# EAGLE schematic lab (EAGLE 7.6.0)
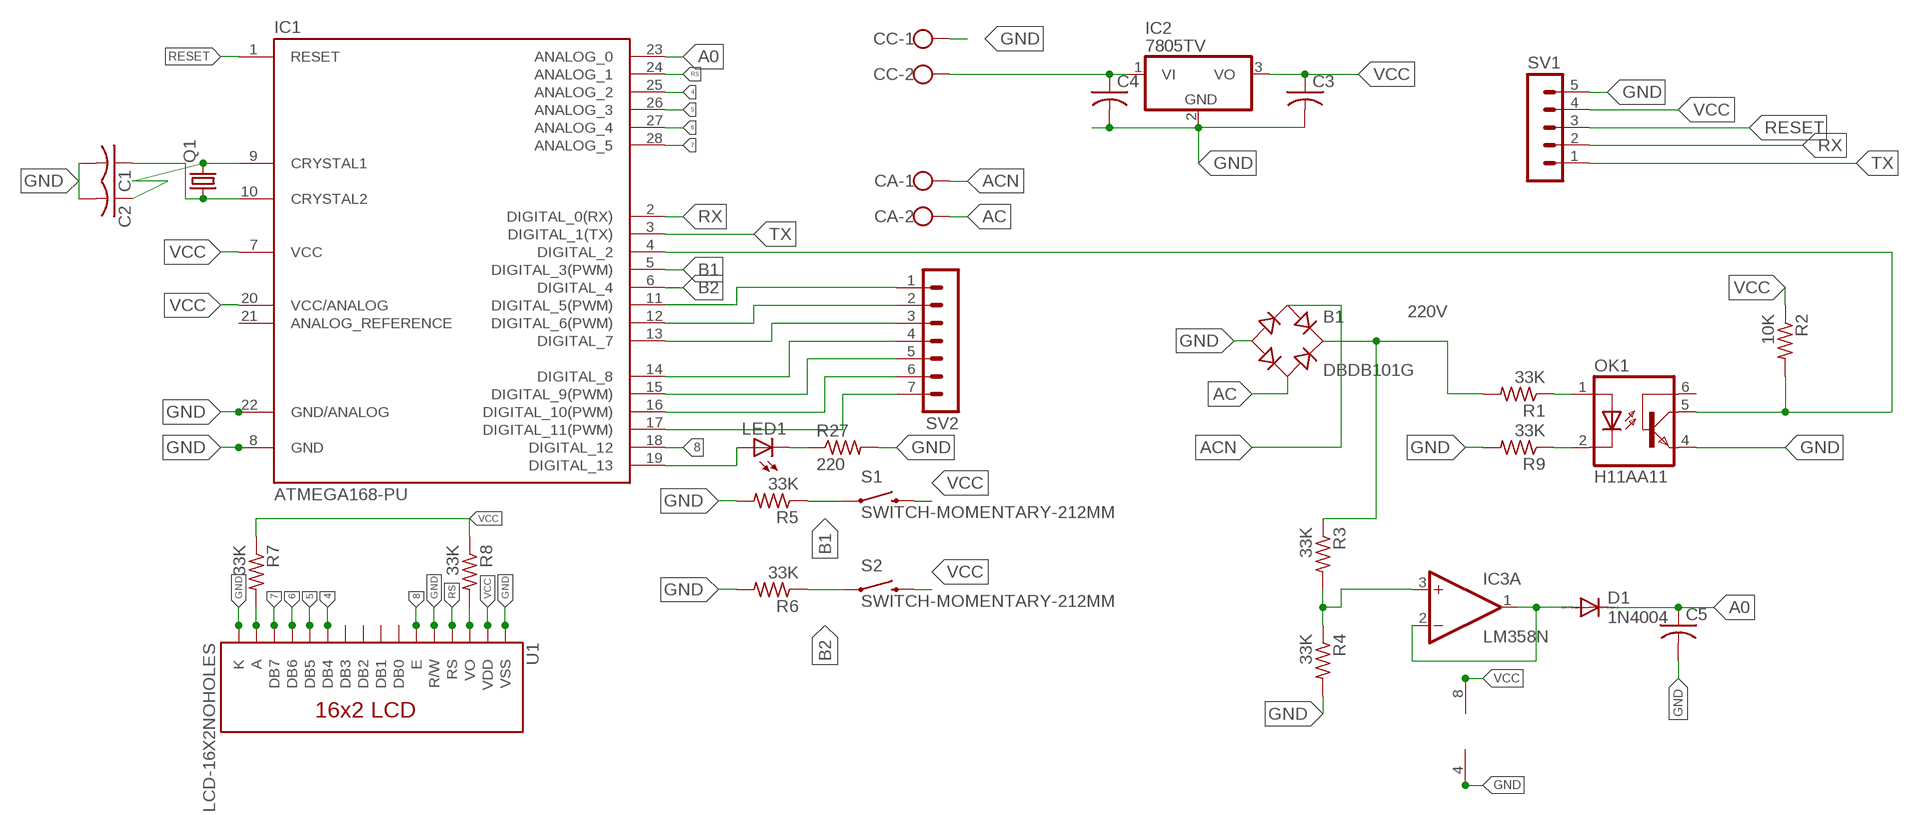
[diagram p0: schematic, sheet 1]

## Parts
B1  DBDB101G  [DB]
C1  C-US025-025X050  [C025-025X050]
C2  C-US025-025X050  [C025-025X050]
C3  C-US050-025X075  [C050-025X075]
C4  C-US050-025X075  [C050-025X075]
C5  C-US050-025X075  [C050-025X075]
CA  W237-102  [W237-102]
CC  W237-102  [W237-102]
D1  1N4004  [DO41-10]
IC1  ATMEGA168-PU  [DIL28-3]
IC2  7805TV  [TO220V]
IC3  LM358N  [DIL08]
LED1  LED3MM  [LED3MM]
OK1  H11AA11  [DIL06]
Q1  CRYSTALHC18U-V  [HC18U-V]
R1  33K  R-US_0207/7  [0207/7]
R2  10K  R-US_0207/7  [0207/7]
R3  33K  R-US_0207/7  [0207/7]
R4  33K  R-US_0207/7  [0207/7]
R5  33K  R-US_0207/7  [0207/7]
R6  33K  R-US_0207/7  [0207/7]
R7  33K  R-US_0207/7  [0207/7]
R8  33K  R-US_0207/7  [0207/7]
R9  33K  R-US_0207/7  [0207/7]
R27  220  R-US_0309/10  [0309/10]
S1  SWITCH-MOMENTARY-212MM  [TACTILE-PTH-12MM]
S2  SWITCH-MOMENTARY-212MM  [TACTILE-PTH-12MM]
SV1  MA05-1  [MA05-1]
SV2  MA07-1  [MA07-1]
U1  LCD-16X2NOHOLES  [LCD-16X2_NOHOLES]

## Nets
4: IC1.25(ANALOG_2) U1.11(DB4)
5: IC1.26(ANALOG_3) U1.12(DB5)
6: IC1.27(ANALOG_4) U1.13(DB6)
7: IC1.28(ANALOG_5) U1.14(DB7)
8: IC1.18(DIGITAL_12) U1.6(E)
220V: B1.+ R1.2 R3.1
A0: C5.1 D1.C IC1.23(ANALOG_0)
AC: B1.AC2 CA.2
ACN: B1.AC1 CA.1
B1: IC1.5(DIGITAL_3(PWM)) R5.1 S1.1
B2: IC1.6(DIGITAL_4) R6.1 S2.1
DIG02: IC1.4(DIGITAL_2) OK1.5(COL) R2.2
GND: B1.- C1.2 C2.2 C3.2 C4.2 C5.2 CC.1 IC1.8(GND) IC1.22(GND/ANALOG) IC2.2(GND) IC3.4(P:V-) OK1.4(EMI) R4.2 R5.2 R6.2 R9.2 R27.2 SV1.5 U1.1(VSS) U1.5(R/W) U1.16(K)
N$1: R7.2 U1.15(A)
N$2: D1.A IC3.1(A:OUT) IC3.2(A:-IN)
N$3: IC3.3(A:+IN) R3.2 R4.1
N$4: OK1.2(C) R9.1
N$5: IC1.11(DIGITAL_5(PWM)) SV2.1
N$6: OK1.1(A) R1.1
N$7: LED1.K(C) R27.1
N$8: C2.1 IC1.9(CRYSTAL1) Q1.2
N$9: C1.1 IC1.10(CRYSTAL2) Q1.1
N$10: IC1.12(DIGITAL_6(PWM)) SV2.2
N$11: IC1.13(DIGITAL_7) SV2.3
N$12: C4.1 CC.2 IC2.1(VI)
N$13: IC1.14(DIGITAL_8) SV2.4
N$14: IC1.15(DIGITAL_9(PWM)) SV2.5
N$15: IC1.16(DIGITAL_10(PWM)) SV2.6
N$16: R8.2 U1.3(VO)
N$17: IC1.17(DIGITAL_11(PWM)) SV2.7
N$26: IC1.19(DIGITAL_13) LED1.A
RESET: IC1.1(RESET) SV1.3
RS: IC1.24(ANALOG_1) U1.4(RS)
RX: IC1.2(DIGITAL_0(RX)) SV1.2
TX: IC1.3(DIGITAL_1(TX)) SV1.1
VCC: C3.1 IC1.7(VCC) IC1.20(VCC/ANALOG) IC2.3(VO) IC3.8(P:V+) R2.1 R7.1 R8.1 S1.3 S2.3 SV1.4 U1.2(VDD)
Unconnected: IC1.21(ANALOG_REFERENCE) IC3.5(B:+IN) IC3.6(B:-IN) IC3.7(B:OUT) OK1.6(BAS) U1.7(DB0) U1.8(DB1) U1.9(DB2) U1.10(DB3)

## Library data of the parts
B1 = rectifier:DB?*G: Single Phase 1.0 AMP Glass Passivated Bridge Rectifier Taiwan Semiconductor Co.,Ltd. - TSC Source: http://www.taiwansemi.com/TSCbig5/ezcatfiles/cust/img/img/db101g.pdf http://www.ts.com.tw/db/pictures/modules/PDT/PDT060207001/DBLS201G.pdf
C1-C5 = adafruit:C-US: CAPACITOR, American symbol
CA CC = con-wago-500:W237-102: WAGO SCREW CLAMP; MPN: 237-102; OC_FARNELL: unknown; OC_NEWARK: 70K9898
D1 = diode:1N4004: DIODE general purpose rectifier, 1 A
IC1 = Arduino-AVR:ATMEGA168-PU
IC2 = linear:78*: Positive VOLTAGE REGULATOR Source: http://cache.national.com/ds/LM/LM78L05.pdf http://www.fairchildsemi.com/ds/LM/LM7805.pdf
IC3 = linear:LM358: OP AMP also LM158; LM258; LM2904 Source: http://cache.national.com/ds/LM/LM158.pdf
LED1 = led:LED: LED OSRAM: - CHIPLED LG R971, LG N971, LY N971, LG Q971, LY Q971, LO R971, LY R971 LH N974, LH R974 LS Q976, LO Q976, LY Q976 LO Q996 - Hyper CHIPLED LW Q18S LB Q993, LB Q99A, LB R99A - SideLED LS A670, LO A670, LY A670, LG A670, LP A670 LB A673, LV A673, LT A673, LW A673 LH A674 LY A675 LS A676, LA A676, LO A676, LY A676, LW A676 LS A679, LY A679, LG A679 - Hyper Micro SIDELED® LS Y876, LA Y876, LO Y876, LY Y876 LT Y87S - SmartLED LW L88C, LW L88S LB L89C, LB L89S, LG L890 LS L89K, LO L89K, LY L89K LS L896, LA L896, LO L896, LY L896 - TOPLED LS T670, LO T670, LY T670, LG T670, LP T670 LSG T670, LSP T670, LSY T670, LOP T670, LYG T670 LG T671, LOG T671, LSG T671 LB T673, LV T673, LT T673, LW T673 LH T674 LS T676, LA T676, LO T676, LY T676, LB T676, LH T676, LSB T676, LW T676 LB T67C, LV T67C, LT T67C, LS T67K, LO T67K, LY T67K, LW E67C LS E67B, LA E67B, LO E67B, LY E67B, LB E67C, LV E67C, LT E67C LW T67C LS T679, LY T679, LG T679 LS T770, LO T770, LY T770, LG T770, LP T770 LB T773, LV T773, LT T773, LW T773 LH T774 LS E675, LA E675, LY E675, LS T675 LS T776, LA T776, LO T776, LY T776, LB T776 LHGB T686 LT T68C, LB T68C - Hyper Mini TOPLED® LB M676 - Mini TOPLED Santana® LG M470 LS M47K, LO M47K, LY M47K Source: http://www.osram.convergy.de LUXEON: - LUMILED® LXK2-PW12-R00, LXK2-PW12-S00, LXK2-PW14-U00, LXK2-PW14-V00 LXK2-PM12-R00, LXK2-PM12-S00, LXK2-PM14-U00 LXK2-PE12-Q00, LXK2-PE12-R00, LXK2-PE12-S00, LXK2-PE14-T00, LXK2-PE14-U00 LXK2-PB12-K00, LXK2-PB12-L00, LXK2-PB12-M00, LXK2-PB14-N00, LXK2-PB14-P00, LXK2-PB14-Q00 LXK2-PR12-L00, LXK2-PR12-M00, LXK2-PR14-Q00, LXK2-PR14-R00 LXK2-PD12-Q00, LXK2-PD12-R00, LXK2-PD12-S00 LXK2-PH12-R00, LXK2-PH12-S00 LXK2-PL12-P00, LXK2-PL12-Q00, LXK2-PL12-R00 Source: www.luxeon.com KINGBRIGHT: KA-3528ASYC Source: www.kingbright.com
OK1 = twomey:H11AA1: Optocoupler AC Input 1 Channel Trans W/Base DC Output 6-Pin DIP Source: http://www.jameco.com/webapp/wcs/stores/servlet/Product_10001_10001_18825_-1; MPN: H11A1-M; OC_FARNELL: 1021358; OC_NEWARK: 97K1793
Q1 = adafruit:CRYSTAL: CRYSTAL; OC_FARNELL: unknown; OC_NEWARK: unknown
R1-R9 = adafruit:R-US_: RESISTOR, American symbol
R27 = rcl:R-US_: RESISTOR, American symbol
S1 S2 = SparkFun-Electromechanical:SWITCH-MOMENTARY-2: Various NO switches- pushbuttons, reed, etc; PROD_ID: SWCH-09185
SV1 = con-lstb:MA05-1: PIN HEADER; OC_FARNELL: unknown; OC_NEWARK: unknown
SV2 = con-lstb:MA07-1: PIN HEADER; OC_FARNELL: unknown; OC_NEWARK: unknown
U1 = SparkFun-Displays:LCD-16X2: Standard text-only 16x2 parallel input LCD